# EAGLE board Oric Tactile KB 1.3b (EAGLE 6.5.0), part 1 of 3
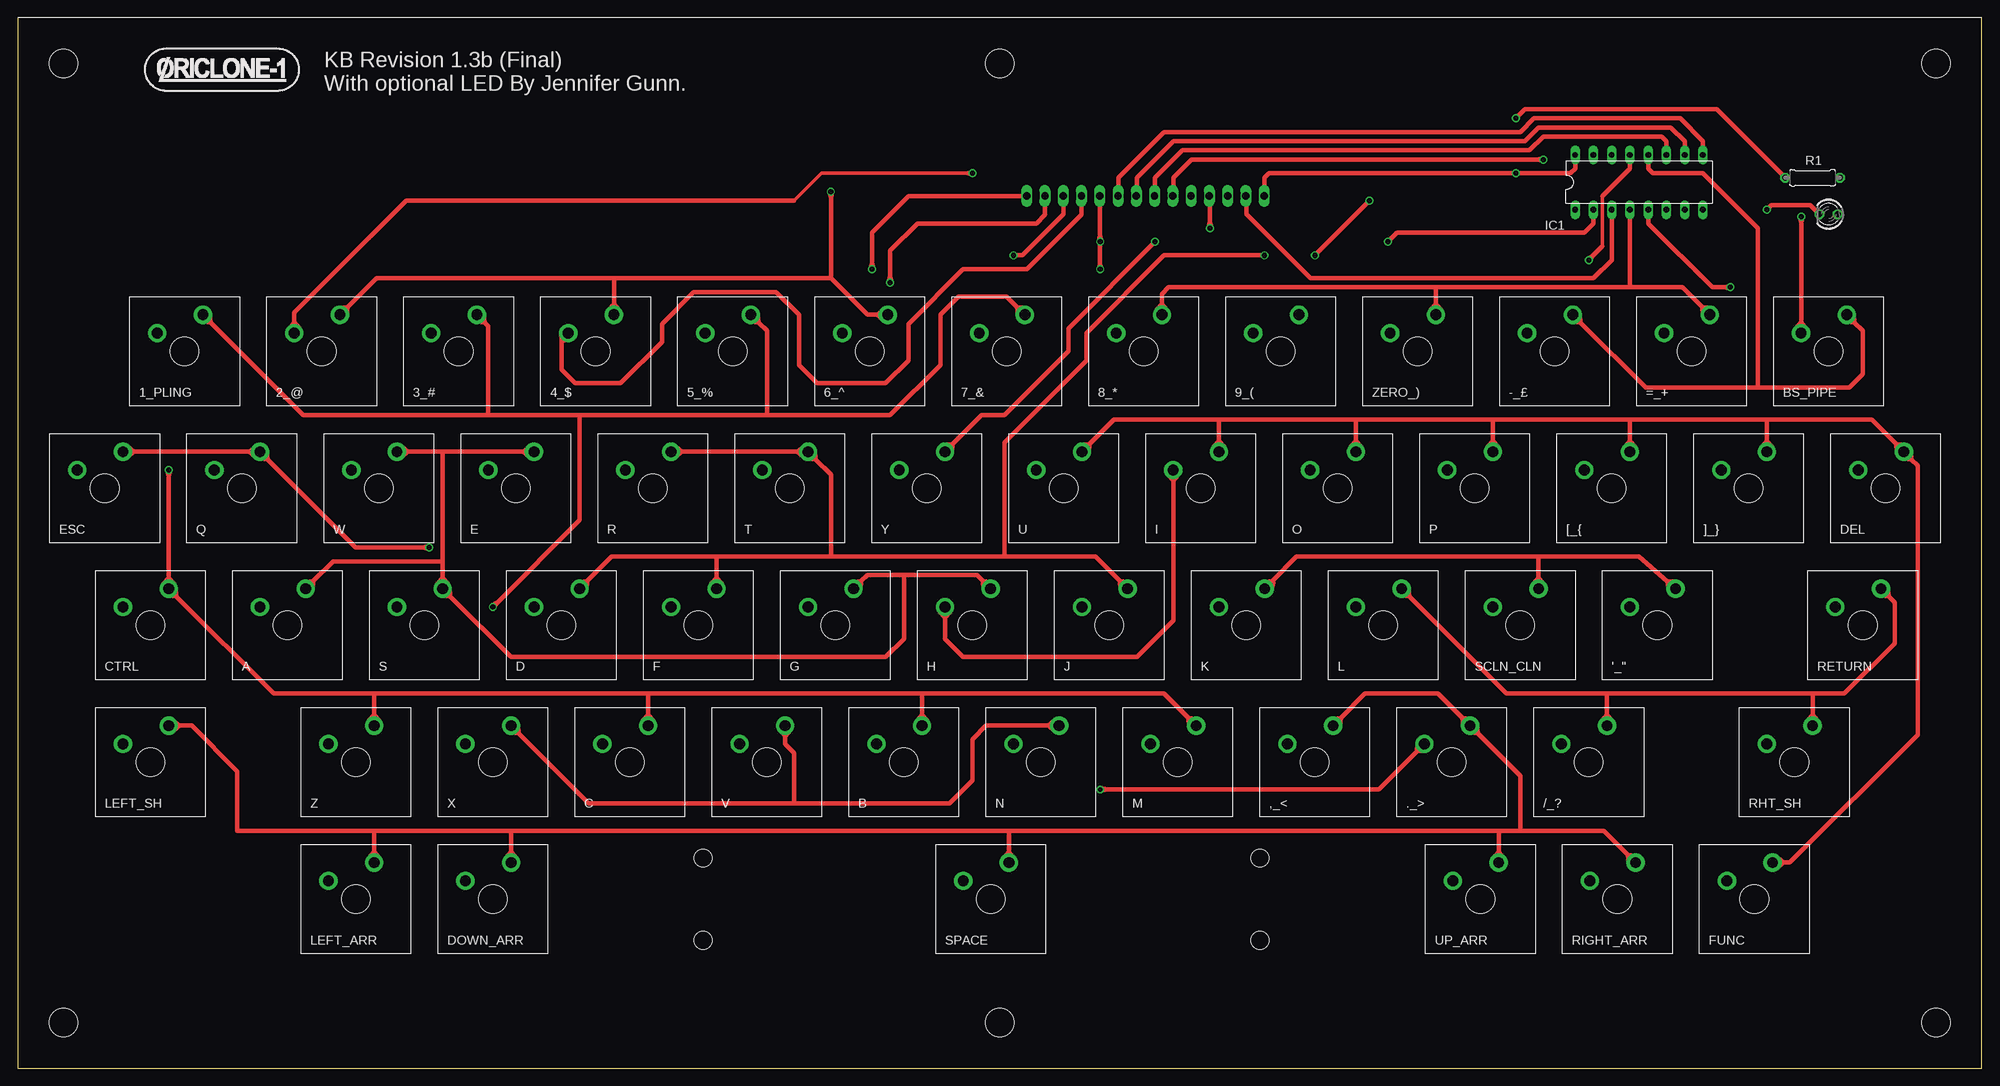
[diagram p2: board, top side]
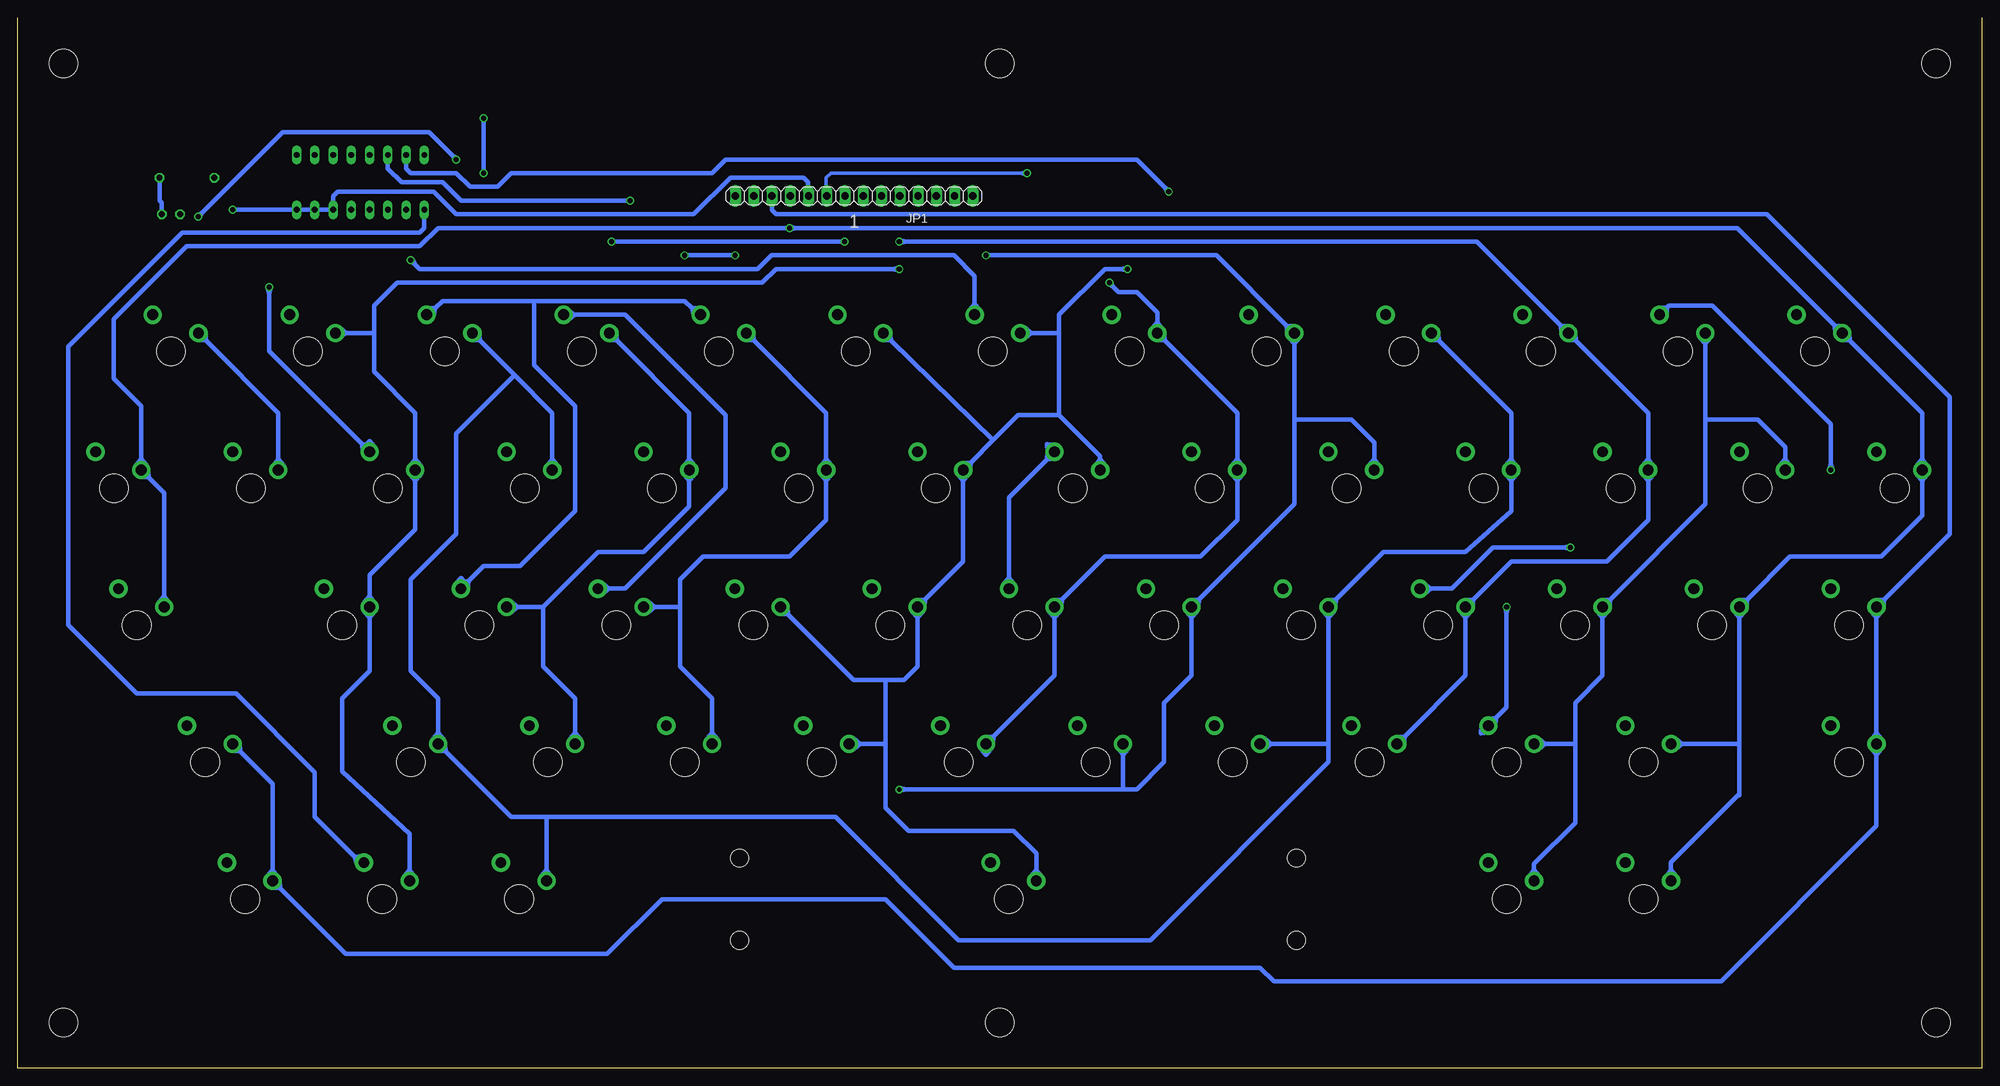
[diagram p3: board, bottom side, seen from below]

Size 273.05 x 146.05 mm. Coordinates in mm from the lower left corner, seen from the top.
Outline: 273.05,146.05 273.05,0 0,0 0,146.05
Copper layers (1*16): Top 0.035mm / dielectric 1.5mm / Bottom 0.035mm
Design rules "default": minimum track width 10mil, minimum drill 24mil, track to track 8mil, track to pad 8mil, pad to pad 8mil, via to via 8mil, smd to smd 8mil, copper to edge 40mil, drill to drill 8mil, minimum pad ring 10mil, minimum via ring 8mil, stop-mask expansion 4mil, vias tented up to drill 0mil, thermal gap 10mil
Net classes: 0 default: width 0.61 mm, clearance 0.254 mm
Holes 2.5 mm at 172.72,29.21 172.72,17.78 95.25,17.78 95.25,29.21
Holes 4 mm at 6.35,6.35 6.35,139.7 136.53,6.35 136.53,139.7 266.7,139.7 266.7,6.35

## Footprints (pad centres in the part's own frame; a part is rotated, then mirrored left to right if it is on the bottom)
CHERRY-MX = drill 1.5 pad 2.54: SW1 -3.81,2.54; SW2 2.54,5.08 | hole 4: 0,0
DIL16 = drill 0.813 long: 1 -8.89,-3.81; 2 -6.35,-3.81; 3 -3.81,-3.81; 4 -1.27,-3.81; 5 1.27,-3.81; 6 3.81,-3.81; 7 6.35,-3.81; 8 8.89,-3.81; 9 8.89,3.81; 10 6.35,3.81; 11 3.81,3.81; 12 1.27,3.81; 13 -1.27,3.81; 14 -3.81,3.81; 15 -6.35,3.81; 16 -8.89,3.81
1X14 = drill 1.016 long: 1 -16.51,0; 2 -13.97,0; 3 -11.43,0; 4 -8.89,0; 5 -6.35,0; 6 -3.81,0; 7 -1.27,0; 8 1.27,0; 9 3.81,0; 10 6.35,0; 11 8.89,0; 12 11.43,0; 13 13.97,0; 14 16.51,0
LED3MM = drill 0.813 octagon: A -1.27,0; K 1.27,0
0207/7 = drill 0.813 octagon: 1 -3.81,0; 2 3.81,0

## Placement (x,y rotation side)
1_PLING  CHERRY-MX  [CHERRY-MX]  23.18,99.69 0 top
2_@  CHERRY-MX  [CHERRY-MX]  42.23,99.69 0 top
3_#  CHERRY-MX  [CHERRY-MX]  61.28,99.69 0 top
4_$  CHERRY-MX  [CHERRY-MX]  80.33,99.69 0 top
5_%  CHERRY-MX  [CHERRY-MX]  99.38,99.69 0 top
6_^  CHERRY-MX  [CHERRY-MX]  118.43,99.69 0 top
7_&  CHERRY-MX  [CHERRY-MX]  137.48,99.69 0 top
8_*  CHERRY-MX  [CHERRY-MX]  156.53,99.69 0 top
9_(  CHERRY-MX  [CHERRY-MX]  175.58,99.69 0 top
'_"  CHERRY-MX  [CHERRY-MX]  227.97,61.59 0 top
,_<  CHERRY-MX  [CHERRY-MX]  180.34,42.55 0 top
-_£  CHERRY-MX  [CHERRY-MX]  213.68,99.69 0 top
._>  CHERRY-MX  [CHERRY-MX]  199.39,42.55 0 top
/_?  CHERRY-MX  [CHERRY-MX]  218.44,42.55 0 top
=_+  CHERRY-MX  [CHERRY-MX]  232.73,99.69 0 top
[_{  CHERRY-MX  [CHERRY-MX]  221.62,80.64 0 top
]_}  CHERRY-MX  [CHERRY-MX]  240.66,80.64 0 top
A  CHERRY-MX  [CHERRY-MX]  37.47,61.59 0 top
B  CHERRY-MX  [CHERRY-MX]  123.19,42.55 0 top
BS_PIPE  CHERRY-MX  [CHERRY-MX]  251.78,99.69 0 top
C  CHERRY-MX  [CHERRY-MX]  85.09,42.55 0 top
CTRL  CHERRY-MX  [CHERRY-MX]  18.41,61.59 0 top
D  CHERRY-MX  [CHERRY-MX]  75.56,61.59 0 top
DEL  CHERRY-MX  [CHERRY-MX]  259.71,80.64 0 top
DOWN_ARR  CHERRY-MX  [CHERRY-MX]  66.04,23.5 0 top
E  CHERRY-MX  [CHERRY-MX]  69.22,80.64 0 top
ESC  CHERRY-MX  [CHERRY-MX]  12.06,80.64 0 top
F  CHERRY-MX  [CHERRY-MX]  94.61,61.59 0 top
FUNC  CHERRY-MX  [CHERRY-MX]  241.46,23.5 0 top
G  CHERRY-MX  [CHERRY-MX]  113.67,61.59 0 top
H  CHERRY-MX  [CHERRY-MX]  132.72,61.59 0 top
I  CHERRY-MX  [CHERRY-MX]  164.47,80.64 0 top
IC1  4051N  [DIL16]  225.43,123.19 0 top
J  CHERRY-MX  [CHERRY-MX]  151.76,61.59 0 top
JP1  [1X14]  156.78,121.28 180 bottom
K  CHERRY-MX  [CHERRY-MX]  170.81,61.59 0 top
L  CHERRY-MX  [CHERRY-MX]  189.87,61.59 0 top
LED1  P-LED  [LED3MM]  251.78,118.75 180 top
LEFT_ARR  CHERRY-MX  [CHERRY-MX]  46.99,23.5 0 top
LEFT_SH  CHERRY-MX  [CHERRY-MX]  18.41,42.55 0 top
M  CHERRY-MX  [CHERRY-MX]  161.29,42.55 0 top
N  CHERRY-MX  [CHERRY-MX]  142.24,42.55 0 top
O  CHERRY-MX  [CHERRY-MX]  183.51,80.64 0 top
P  CHERRY-MX  [CHERRY-MX]  202.56,80.64 0 top
Q  CHERRY-MX  [CHERRY-MX]  31.11,80.64 0 top
R  CHERRY-MX  [CHERRY-MX]  88.27,80.64 0 top
R1  1K2  [0207/7]  249.56,123.83 180 top
RETURN  CHERRY-MX  [CHERRY-MX]  256.54,61.59 0 top
RHT_SH  CHERRY-MX  [CHERRY-MX]  247.01,42.55 0 top
RIGHT_ARR  CHERRY-MX  [CHERRY-MX]  222.41,23.5 0 top
S  CHERRY-MX  [CHERRY-MX]  56.52,61.59 0 top
SCLN_CLN  CHERRY-MX  [CHERRY-MX]  208.91,61.59 0 top
SPACE  CHERRY-MX  [CHERRY-MX]  135.25,23.5 0 top
T  CHERRY-MX  [CHERRY-MX]  107.31,80.64 0 top
U  CHERRY-MX  [CHERRY-MX]  145.41,80.64 0 top
U$1  [ORICLONE-1]  27.94,139.06 0 top
UP_ARR  CHERRY-MX  [CHERRY-MX]  203.36,23.5 0 top
V  CHERRY-MX  [CHERRY-MX]  104.14,42.55 0 top
W  CHERRY-MX  [CHERRY-MX]  50.16,80.64 0 top
X  CHERRY-MX  [CHERRY-MX]  66.04,42.55 0 top
Y  CHERRY-MX  [CHERRY-MX]  126.36,80.64 0 top
Z  CHERRY-MX  [CHERRY-MX]  46.99,42.55 0 top
ZERO_)  CHERRY-MX  [CHERRY-MX]  194.63,99.69 0 top

## Tracks (layer width: path | path; a pad name or v marks a point on that pad's centre or on a via)
+5V  (via drill 0.7)
  Top 0.61: JP1.14 173.35,123.83 173.99,124.46 v208.28,124.46 215.9,124.46 216.53,125.09 IC1.16 | R1.2 236.22,133.35 209.55,133.35 v208.28,132.08
  Bottom 0.61: v208.28,132.08 v208.28,124.46
COL_0  (via drill 0.7)
  Top 0.61: v118.75,111.12 118.75,112.04 | 118.75,112.04 118.75,116.2 123.83,121.28 JP1.1 | 118.55,111.17 | 118.75,112.04 118.55,111.17 | 118.75,112.04 118.55,111.17 | v118.75,111.12 118.55,111.17 | 118.75,112.04 | 118.75,112.04 118.94,111.17 | 118.75,112.04 118.55,111.17 | 118.75,112.04 118.94,111.17 | 118.94,111.17 | 118.75,112.04 118.55,111.17 | 118.75,112.04 118.94,111.17 | v118.75,111.12 118.94,111.17 | 118.75,112.04 118.55,111.17 | v118.75,111.12 118.55,111.17 | 118.75,112.04 118.94,111.17 | v118.75,111.12 118.94,111.17
  Bottom 0.61: U.SW1 140.54,84.25 | 140.54,84.25 | 140.54,84.25 137.48,87.31 | 137.48,87.31 133.99,90.81 128.27,90.81 | J.SW1 146.89,65.2 | 146.89,65.2 | 146.89,65.2 141.6,70.48 141.6,81.69 | 141.6,81.69 | 141.6,81.69 U.SW1 | 147.96,62.63 147.96,55.88 149.86,53.98 152.4,53.98 | 147.96,62.63 | 147.96,62.63 J.SW1 | SPACE.SW1 131.44,27.54 | 131.44,27.54 | 131.44,27.54 131.44,29.84 134.62,33.02 149.22,33.02 152.4,36.2 152.4,45.09 | 119.66,111.12 121.92,111.12 128.27,104.78 128.27,102.23 | 119.66,111.12 v118.75,111.12 | 152.4,53.98 152.4,45.09 | M.SW1 155.98,45.09 | 155.98,45.09 | 155.98,45.09 152.4,45.09 | 128.27,102.23 128.27,90.81 | Y.SW1 122.56,84.69 | 122.56,84.69 | 122.56,84.69 122.56,85.09 128.27,90.81 | 128.27,102.23 132.17,102.23 | 132.17,102.23 | 132.17,102.23 7_&.SW1 | 140.54,84.25 | 140.54,84.25 140.64,83.1 | 140.64,83.1 | 140.54,84.25 141.69,84.15 | 141.69,84.15 | 141.6,81.69 142.34,82.56 | 146.89,65.2 | 146.89,65.2 146.99,64.05 | 146.99,64.05 | 146.89,65.2 148.04,65.1 | 148.04,65.1 | 147.96,62.63 148.69,63.51 | J.SW1 148.58,64.87 J.SW1 | J.SW1 148.58,63.4 J.SW1 | 8_*.SW1 151.65,101.19 | 151.65,101.19 137.48,87.31 | K.SW1 165.94,63.07 | 165.94,63.07 156.84,53.98 152.4,53.98 | 118.79,111.32 | 118.79,110.93 | 151.65,101.19 | 151.65,101.19 | 151.65,101.19 151.76,102.33 | U.SW1 140.87,83.81 U.SW1 | J.SW1 147.33,63.4 | 147.33,64.87 | 119.66,111.12 118.79,111.32 | 119.66,111.12 | 119.66,111.12 118.79,110.93 | 119.66,111.12 118.79,111.32 | v118.75,111.12 118.79,111.32 | 119.66,111.12 118.79,110.93 | v118.75,111.12 118.79,110.93 | 119.66,111.12 118.79,111.32 | 119.66,111.12 118.79,110.93 | 119.66,111.12 118.79,111.32 | v118.75,111.12 118.79,111.32 | 119.66,111.12 118.79,110.93 | v118.75,111.12 118.79,110.93
  Bottom 0.61: 151.65,101.19 152.79,101.27 | 8_*.SW1 152.79,101.27 | 151.65,101.19 151.76,102.33 | 8_*.SW1 151.76,102.33 | 151.65,101.19 152.79,101.27 | 151.65,101.19 151.76,102.33 | 8_*.SW1 151.76,102.33 | 151.65,101.19 152.79,101.27 | 8_*.SW1 152.79,101.27 | 151.65,101.19 151.76,102.33 | 8_*.SW1 151.76,102.33 | 122.56,84.69 121.82,83.81 | 122.56,84.69 | 122.56,84.69 121.82,83.81 | Y.SW1 121.82,83.81 | 122.56,84.69 123.29,83.81 | 122.56,84.69 | 122.56,84.69 121.82,83.81 | 122.56,84.69 | 122.56,84.69 123.29,83.81 | 123.29,83.81 | 122.56,84.69 123.29,83.81 | 122.56,84.69 123.29,83.81 | Y.SW1 123.29,83.81 | 122.56,84.69 121.82,83.81 | Y.SW1 121.82,83.81 | 122.56,84.69 123.29,83.81 | 123.29,83.81 | 122.56,84.69 121.82,83.81 | 121.82,83.81 | Y.SW1 121.82,83.81 | 122.56,84.69 123.29,83.81 | Y.SW1 123.29,83.81 | 122.56,84.69 121.82,83.81 | Y.SW1 121.82,83.81 | 122.56,84.69 123.29,83.81 | Y.SW1 123.29,83.81 | U.SW1 142.34,83.81 | 141.6,81.69 140.87,82.56 | 140.54,84.25 140.64,83.1 | 140.64,83.1 | 140.54,84.25 | 140.54,84.25 140.64,83.1 | U.SW1 140.64,83.1 | 140.54,84.25 141.69,84.15 | 141.69,84.15 | U.SW1 141.69,84.15 | 141.6,81.69 | 141.6,81.69 142.34,82.56 | 142.34,82.56 | 141.6,81.69 | 141.6,81.69 140.87,82.56 | 141.6,81.69 142.34,82.56 | U.SW1 142.34,82.56 | 141.6,81.69 | 141.6,81.69 140.87,82.56 | U.SW1 140.87,82.56 | 140.54,84.25 140.64,83.1 | U.SW1 140.64,83.1 | 140.54,84.25 141.69,84.15 | U.SW1 141.69,84.15 | 141.6,81.69 142.34,82.56 | 141.6,81.69 140.87,82.56 | 140.87,82.56 | U.SW1 140.87,82.56 | 141.6,81.69 142.34,82.56 | 142.34,82.56 | U.SW1 142.34,82.56 | 141.6,81.69 140.87,82.56 | U.SW1 140.87,82.56 | 141.6,81.69 142.34,82.56 | U.SW1 142.34,82.56 | 141.6,81.69 140.87,82.56 | U.SW1 140.87,82.56 | 131.44,27.54 130.71,26.66
  Bottom 0.61: 131.44,27.54 | 131.44,27.54 130.71,26.66 | SPACE.SW1 130.71,26.66 | 131.44,27.54 132.18,26.66 | 131.44,27.54 | 131.44,27.54 130.71,26.66 | 131.44,27.54 | 131.44,27.54 132.18,26.66 | 132.18,26.66 | 131.44,27.54 132.18,26.66 | 131.44,27.54 132.18,26.66 | SPACE.SW1 132.18,26.66 | 131.44,27.54 130.71,26.66 | SPACE.SW1 130.71,26.66 | 131.44,27.54 132.18,26.66 | 132.18,26.66 | 131.44,27.54 130.71,26.66 | 130.71,26.66 | SPACE.SW1 130.71,26.66 | 131.44,27.54 132.18,26.66 | SPACE.SW1 132.18,26.66 | 131.44,27.54 130.71,26.66 | SPACE.SW1 130.71,26.66 | 131.44,27.54 132.18,26.66 | SPACE.SW1 132.18,26.66 | 165.94,63.07 | 165.94,63.07 167.09,63.17 | 167.09,63.17 | 165.94,63.07 | 165.94,63.07 166.04,64.22 | 166.04,64.22 | 165.94,63.07 167.09,63.17 | 167.09,63.17 | K.SW1 167.09,63.17 | 165.94,63.07 166.04,64.22 | K.SW1 166.04,64.22 | 165.94,63.07 167.09,63.17 | K.SW1 167.09,63.17 | 165.94,63.07 166.04,64.22 | K.SW1 166.04,64.22 | 155.98,45.09 156.86,44.35 | 155.98,45.09 | 155.98,45.09 156.86,44.35 | M.SW1 156.86,44.35 | 155.98,45.09 156.86,45.82 | 155.98,45.09 | 155.98,45.09 156.86,44.35 | 155.98,45.09 | 155.98,45.09 156.86,45.82 | 156.86,45.82 | 155.98,45.09 156.86,45.82 | 155.98,45.09 156.86,45.82 | M.SW1 156.86,45.82 | 155.98,45.09 156.86,44.35 | M.SW1 156.86,44.35 | 155.98,45.09 156.86,45.82 | 156.86,45.82 | 155.98,45.09 156.86,44.35 | 156.86,44.35 | M.SW1 156.86,44.35 | 155.98,45.09 156.86,45.82 | M.SW1 156.86,45.82 | 155.98,45.09 156.86,44.35 | M.SW1 156.86,44.35 | 155.98,45.09 156.86,45.82 | M.SW1 156.86,45.82 | 147.33,64.87 | 147.96,62.63 147.22,63.51 | 146.89,65.2 146.99,64.05 | 146.99,64.05 | 146.89,65.2 | 146.89,65.2 146.99,64.05 | J.SW1 146.99,64.05 | 146.89,65.2 148.04,65.1 | 148.04,65.1 | J.SW1 148.04,65.1
  Bottom 0.61: 147.33,63.4 | J.SW1 147.33,63.4 | J.SW1 147.33,64.87 | J.SW1 147.33,63.4 | J.SW1 147.33,64.87 | 147.96,62.63 | 147.96,62.63 148.69,63.51 | 148.69,63.51 | 147.96,62.63 | 147.96,62.63 147.22,63.51 | 147.96,62.63 148.69,63.51 | J.SW1 148.69,63.51 | 147.96,62.63 | 147.96,62.63 147.22,63.51 | J.SW1 147.22,63.51 | 146.89,65.2 146.99,64.05 | J.SW1 146.99,64.05 | 146.89,65.2 148.04,65.1 | J.SW1 148.04,65.1 | 147.96,62.63 148.69,63.51 | 147.96,62.63 147.22,63.51 | 147.22,63.51 | J.SW1 147.22,63.51 | 147.96,62.63 148.69,63.51 | 148.69,63.51 | J.SW1 148.69,63.51 | 147.96,62.63 147.22,63.51 | J.SW1 147.22,63.51 | 147.96,62.63 148.69,63.51 | J.SW1 148.69,63.51 | 147.96,62.63 147.22,63.51 | J.SW1 147.22,63.51 | 132.17,102.23 133.05,101.5 | 132.17,102.23 | 132.17,102.23 133.05,101.5 | 7_&.SW1 133.05,101.5 | 132.17,102.23 133.05,102.97 | 132.17,102.23 | 132.17,102.23 133.05,101.5 | 132.17,102.23 | 132.17,102.23 133.05,102.97 | 133.05,102.97 | 132.17,102.23 133.05,102.97 | 132.17,102.23 133.05,102.97 | 7_&.SW1 133.05,102.97 | 132.17,102.23 133.05,101.5 | 7_&.SW1 133.05,101.5 | 132.17,102.23 133.05,102.97 | 133.05,102.97 | 132.17,102.23 133.05,101.5 | 133.05,101.5 | 7_&.SW1 133.05,101.5 | 132.17,102.23 133.05,102.97 | 7_&.SW1 133.05,102.97 | 132.17,102.23 133.05,101.5 | 7_&.SW1 133.05,101.5 | 132.17,102.23 133.05,102.97 | 7_&.SW1 133.05,102.97
COL_1  (via drill 0.7)
  Top 0.61: v121.28,109.22 121.28,110.13 | 121.28,110.13 121.28,113.67 125.09,117.47 141.6,117.47 142.81,118.67 JP1.2 | 128.91,62.63 128.91,59.69 131.44,57.15 155.57,57.15 160.66,62.23 160.66,81.69 | 128.91,62.63 | 128.91,62.63 H.SW1 | I.SW1 160.66,81.69 | 160.66,81.69 | 128.91,62.63 129.64,63.51 | 160.66,81.69 161.39,82.56 | 121.09,109.27 | 121.28,110.13 121.09,109.27 | 121.28,110.13 121.09,109.27 | v121.28,109.22 121.09,109.27 | 121.28,110.13 | 121.28,110.13 121.48,109.27 | 121.28,110.13 121.09,109.27 | 121.28,110.13 121.48,109.27 | 121.48,109.27 | 121.28,110.13 121.09,109.27 | 121.28,110.13 121.48,109.27 | v121.28,109.22 121.48,109.27 | 121.28,110.13 121.09,109.27 | v121.28,109.22 121.09,109.27 | 121.28,110.13 121.48,109.27 | v121.28,109.22 121.48,109.27 | 128.91,62.63 128.17,63.51 | 128.91,62.63 | 128.91,62.63 129.64,63.51 | 129.64,63.51 | 128.91,62.63 | 128.91,62.63 128.17,63.51 | 128.91,62.63 129.64,63.51 | H.SW1 129.64,63.51 | 128.91,62.63 | 128.91,62.63 128.17,63.51 | H.SW1 128.17,63.51 | 128.91,62.63 129.64,63.51 | 128.91,62.63 128.17,63.51 | 128.17,63.51 | H.SW1 128.17,63.51 | 128.91,62.63 129.64,63.51 | 129.64,63.51 | H.SW1 129.64,63.51 | 128.91,62.63 128.17,63.51 | H.SW1 128.17,63.51 | 128.91,62.63 129.64,63.51 | H.SW1 129.64,63.51 | 128.91,62.63 128.17,63.51 | H.SW1 128.17,63.51 | 160.66,81.69 159.92,82.56 | 160.66,81.69 | 160.66,81.69 161.39,82.56 | 161.39,82.56 | 160.66,81.69 | 160.66,81.69 159.92,82.56 | 160.66,81.69 161.39,82.56 | I.SW1 161.39,82.56 | 160.66,81.69 | 160.66,81.69 159.92,82.56 | I.SW1 159.92,82.56 | 160.66,81.69 161.39,82.56 | 160.66,81.69 159.92,82.56 | 159.92,82.56 | I.SW1 159.92,82.56 | 160.66,81.69 161.39,82.56 | 161.39,82.56 | I.SW1 161.39,82.56 | 160.66,81.69 159.92,82.56
  Top 0.61: I.SW1 159.92,82.56 | 160.66,81.69 161.39,82.56 | I.SW1 161.39,82.56 | 160.66,81.69 159.92,82.56 | I.SW1 159.92,82.56
  Bottom 0.61: 6_^.SW1 113.56,101.17 | 113.56,101.17 103.5,91.12 103.5,84.69 | 103.5,84.69 | 103.5,84.69 T.SW1 | T.SW1 103.5,81.69 | 103.5,81.69 | 103.5,81.69 103.5,76.2 108.58,71.12 121.92,71.12 127.84,65.2 | 127.84,65.2 | 127.84,65.2 H.SW1 | H.SW1 128.91,62.63 | 128.91,62.63 | 128.91,62.63 128.91,54.61 137.37,46.15 | 137.37,46.15 | 137.37,46.15 N.SW1 | 9_(.SW1 170.71,101.17 | 170.71,101.17 160.66,91.12 160.66,84.69 | 160.66,84.69 | 160.66,84.69 I.SW1 | I.SW1 160.66,81.69 | 160.66,81.69 | 160.66,81.69 160.66,76.2 165.74,71.12 177.8,71.12 180.97,67.94 180.97,64.14 | 180.97,64.14 180.97,55.88 176.53,51.44 176.53,46.59 | 176.53,46.59 | 176.53,46.59 ,_<.SW1 | L.SW1 184.56,64.14 | 184.56,64.14 | 184.56,64.14 180.97,64.14 | 6_^.SW1 114.62,103.73 | 114.62,103.73 | 114.62,103.73 114.62,105.09 117.47,107.95 120.02,107.95 120.64,108.57 | 120.64,108.57 v121.28,109.22 | 127.84,65.2 | 127.84,65.2 127.94,64.05 | 127.94,64.05 | 127.84,65.2 128.99,65.1 | 128.99,65.1 | 128.91,62.63 129.64,63.51 | 160.66,81.69 161.39,82.56 | 103.5,81.69 104.24,82.56 | 137.37,46.15 | 137.37,46.15 137.47,45 | 137.47,45 | 137.37,46.15 138.51,46.05 | 138.51,46.05 | 120.64,108.57 121.39,109.05 | 120.64,108.57 121.11,109.33 | 120.64,108.57 121.39,109.05 | 121.39,109.05 | 120.64,108.57 121.11,109.33 | 121.11,109.33 | H.SW1 128.28,63.4 H.SW1 | H.SW1 128.28,64.87 H.SW1 | 120.64,108.57 121.39,109.05 | v121.28,109.22 121.39,109.05 | 120.64,108.57 121.11,109.33 | v121.28,109.22 121.11,109.33 | 120.64,108.57 121.39,109.05 | 120.64,108.57 121.11,109.33 | 120.64,108.57 121.39,109.05 | v121.28,109.22 121.39,109.05 | 120.64,108.57 121.11,109.33 | v121.28,109.22 121.11,109.33 | 120.64,108.57 121.39,109.05 | 120.64,108.57 121.11,109.33
  Bottom 0.61: 120.64,108.57 121.39,109.05 | v121.28,109.22 121.39,109.05 | 120.64,108.57 121.11,109.33 | v121.28,109.22 121.11,109.33 | 184.56,64.14 185.43,63.4 | 184.56,64.14 | 184.56,64.14 185.43,63.4 | L.SW1 185.43,63.4 | 184.56,64.14 185.43,64.87 | 184.56,64.14 | 184.56,64.14 185.43,63.4 | 184.56,64.14 | 184.56,64.14 185.43,64.87 | 185.43,64.87 | 184.56,64.14 185.43,64.87 | 184.56,64.14 185.43,64.87 | L.SW1 185.43,64.87 | 184.56,64.14 185.43,63.4 | L.SW1 185.43,63.4 | 184.56,64.14 185.43,64.87 | 185.43,64.87 | 184.56,64.14 185.43,63.4 | 185.43,63.4 | L.SW1 185.43,63.4 | 184.56,64.14 185.43,64.87 | L.SW1 185.43,64.87 | 184.56,64.14 185.43,63.4 | L.SW1 185.43,63.4 | 184.56,64.14 185.43,64.87 | L.SW1 185.43,64.87 | 128.91,62.63 128.17,63.51 | 127.84,65.2 127.94,64.05 | 127.94,64.05 | 127.84,65.2 | 127.84,65.2 127.94,64.05 | H.SW1 127.94,64.05 | 127.84,65.2 128.99,65.1 | 128.99,65.1 | H.SW1 128.99,65.1 | 128.91,62.63 | 128.91,62.63 129.64,63.51 | 129.64,63.51 | 128.91,62.63 | 128.91,62.63 128.17,63.51 | 128.91,62.63 129.64,63.51 | H.SW1 129.64,63.51 | 128.91,62.63 | 128.91,62.63 128.17,63.51 | H.SW1 128.17,63.51 | 127.84,65.2 127.94,64.05 | H.SW1 127.94,64.05 | 127.84,65.2 128.99,65.1 | H.SW1 128.99,65.1 | 128.91,62.63 129.64,63.51 | 128.91,62.63 128.17,63.51 | 128.17,63.51 | H.SW1 128.17,63.51 | 128.91,62.63 129.64,63.51 | 129.64,63.51 | H.SW1 129.64,63.51 | 128.91,62.63 128.17,63.51 | H.SW1 128.17,63.51 | 128.91,62.63 129.64,63.51 | H.SW1 129.64,63.51 | 128.91,62.63 128.17,63.51 | H.SW1 128.17,63.51 | 160.66,84.69 159.92,83.81 | 160.66,81.69 159.92,82.56 | 160.66,84.69 | 160.66,84.69 159.92,83.81 | I.SW1 159.92,83.81 | 160.66,84.69 161.39,83.81 | 160.66,84.69 | 160.66,84.69 159.92,83.81 | 160.66,84.69 | 160.66,84.69 161.39,83.81
  Bottom 0.61: 161.39,83.81 | 160.66,81.69 | 160.66,81.69 161.39,82.56 | 161.39,82.56 | 160.66,81.69 | 160.66,81.69 159.92,82.56 | 160.66,81.69 161.39,82.56 | I.SW1 161.39,82.56 | 160.66,81.69 | 160.66,81.69 159.92,82.56 | I.SW1 159.92,82.56 | 160.66,84.69 161.39,83.81 | 160.66,84.69 161.39,83.81 | I.SW1 161.39,83.81 | 160.66,84.69 159.92,83.81 | I.SW1 159.92,83.81 | 160.66,84.69 161.39,83.81 | 161.39,83.81 | 160.66,84.69 159.92,83.81 | 159.92,83.81 | I.SW1 159.92,83.81 | 160.66,84.69 161.39,83.81 | I.SW1 161.39,83.81 | 160.66,84.69 159.92,83.81 | I.SW1 159.92,83.81 | 160.66,84.69 161.39,83.81 | I.SW1 161.39,83.81 | 160.66,81.69 161.39,82.56 | 160.66,81.69 159.92,82.56 | 159.92,82.56 | I.SW1 159.92,82.56 | 160.66,81.69 161.39,82.56 | 161.39,82.56 | I.SW1 161.39,82.56 | 160.66,81.69 159.92,82.56 | I.SW1 159.92,82.56 | 160.66,81.69 161.39,82.56 | I.SW1 161.39,82.56 | 160.66,81.69 159.92,82.56 | I.SW1 159.92,82.56 | 176.53,46.59 175.79,45.71 | 176.53,46.59 | 176.53,46.59 175.79,45.71 | ,_<.SW1 175.79,45.71 | 176.53,46.59 177.27,45.71 | 176.53,46.59 | 176.53,46.59 175.79,45.71 | 176.53,46.59 | 176.53,46.59 177.27,45.71 | 177.27,45.71 | 176.53,46.59 177.27,45.71 | 176.53,46.59 177.27,45.71 | ,_<.SW1 177.27,45.71 | 176.53,46.59 175.79,45.71 | ,_<.SW1 175.79,45.71 | 176.53,46.59 177.27,45.71 | 177.27,45.71 | 176.53,46.59 175.79,45.71 | 175.79,45.71 | ,_<.SW1 175.79,45.71 | 176.53,46.59 177.27,45.71 | ,_<.SW1 177.27,45.71 | 176.53,46.59 175.79,45.71 | ,_<.SW1 175.79,45.71 | 176.53,46.59 177.27,45.71 | ,_<.SW1 177.27,45.71 | 170.71,101.17 | 170.71,101.17 171.85,101.27 | 171.85,101.27 | 170.71,101.17 | 170.71,101.17 170.81,102.32 | 170.81,102.32 | 170.71,101.17 170.81,102.32 | 170.81,102.32 | 170.71,101.17 171.85,101.27
  Bottom 0.61: 171.85,101.27 | 9_(.SW1 171.85,101.27 | 170.71,101.17 170.81,102.32 | 9_(.SW1 170.81,102.32 | 170.71,101.17 171.85,101.27 | 9_(.SW1 171.85,101.27 | 170.71,101.17 170.81,102.32 | 9_(.SW1 170.81,102.32 | 113.56,101.17 | 113.56,101.17 114.7,101.27 | 114.7,101.27 | 113.56,101.17 | 113.56,101.17 113.66,102.32 | 113.66,102.32 | 114.62,103.73 113.88,102.86 | 113.56,101.17 113.66,102.32 | 113.66,102.32 | 114.62,103.73 | 114.62,103.73 113.88,102.86 | 6_^.SW1 113.88,102.86 | 114.62,103.73 115.36,102.86 | 114.62,103.73 | 114.62,103.73 113.88,102.86 | 114.62,103.73 | 114.62,103.73 115.36,102.86 | 115.36,102.86 | 113.56,101.17 114.7,101.27 | 114.7,101.27 | 6_^.SW1 114.7,101.27 | 113.56,101.17 113.66,102.32 | 6_^.SW1 113.66,102.32 | 113.56,101.17 114.7,101.27 | 6_^.SW1 114.7,101.27 | 113.56,101.17 113.66,102.32 | 6_^.SW1 113.66,102.32 | 114.62,103.73 115.36,102.86 | 114.62,103.73 115.36,102.86 | 6_^.SW1 115.36,102.86 | 114.62,103.73 113.88,102.86 | 6_^.SW1 113.88,102.86 | 114.62,103.73 115.36,102.86 | 115.36,102.86 | 114.62,103.73 113.88,102.86 | 113.88,102.86 | 6_^.SW1 113.88,102.86 | 114.62,103.73 115.36,102.86 | 6_^.SW1 115.36,102.86 | 114.62,103.73 113.88,102.86 | 6_^.SW1 113.88,102.86 | 114.62,103.73 115.36,102.86 | 6_^.SW1 115.36,102.86 | 103.5,84.69 102.77,83.81 | 103.5,81.69 102.77,82.56 | 103.5,84.69 | 103.5,84.69 102.77,83.81 | T.SW1 102.77,83.81 | 103.5,84.69 104.24,83.81 | 103.5,84.69 | 103.5,84.69 102.77,83.81 | 103.5,84.69 | 103.5,84.69 104.24,83.81 | 104.24,83.81 | 103.5,81.69 | 103.5,81.69 104.24,82.56 | 104.24,82.56 | 103.5,81.69 | 103.5,81.69 102.77,82.56 | 103.5,81.69 104.24,82.56 | T.SW1 104.24,82.56 | 103.5,81.69 | 103.5,81.69 102.77,82.56 | T.SW1 102.77,82.56 | 103.5,84.69 104.24,83.81
  Bottom 0.61: 103.5,84.69 104.24,83.81 | T.SW1 104.24,83.81 | 103.5,84.69 102.77,83.81 | T.SW1 102.77,83.81 | 103.5,84.69 104.24,83.81 | 104.24,83.81 | 103.5,84.69 102.77,83.81 | 102.77,83.81 | T.SW1 102.77,83.81 | 103.5,84.69 104.24,83.81 | T.SW1 104.24,83.81 | 103.5,84.69 102.77,83.81 | T.SW1 102.77,83.81 | 103.5,84.69 104.24,83.81 | T.SW1 104.24,83.81 | 103.5,81.69 104.24,82.56 | 103.5,81.69 102.77,82.56 | 102.77,82.56 | T.SW1 102.77,82.56 | 103.5,81.69 104.24,82.56 | 104.24,82.56 | T.SW1 104.24,82.56 | 103.5,81.69 102.77,82.56 | T.SW1 102.77,82.56 | 103.5,81.69 104.24,82.56 | T.SW1 104.24,82.56 | 103.5,81.69 102.77,82.56 | T.SW1 102.77,82.56 | N.SW1 139.17,44.46 138.43,43.59 137.69,44.46 N.SW1 | 137.37,46.15 137.47,45 | 137.47,45 | 137.37,46.15 | 137.37,46.15 137.47,45 | N.SW1 137.47,45 | 137.37,46.15 138.51,46.05 | 138.51,46.05 | N.SW1 138.51,46.05 | 137.37,46.15 137.47,45 | N.SW1 137.47,45 | 137.37,46.15 138.51,46.05 | N.SW1 138.51,46.05
COL_2  (via drill 0.61, 0.7)
  Top 0.61: 151.41,38.73 189.23,38.73 194.52,44.02 | 151.41,38.73 v150.5,38.73 | ._>.SW1 194.52,44.02 | 150.54,38.93 | 150.54,38.54 | 151.41,38.73 150.54,38.93 | 151.41,38.73 | 151.41,38.73 150.54,38.54 | 151.41,38.73 150.54,38.93 | v150.5,38.73 150.54,38.93 | 151.41,38.73 150.54,38.54 | v150.5,38.73 150.54,38.54 | 151.41,38.73 150.54,38.93 | 151.41,38.73 150.54,38.54 | 151.41,38.73 150.54,38.93 | v150.5,38.73 150.54,38.93 | 151.41,38.73 150.54,38.54 | v150.5,38.73 150.54,38.54 | 194.52,44.02 | 194.52,44.02 195.66,44.12 | 195.66,44.12 | 194.52,44.02 | 194.52,44.02 194.62,45.17 | 194.62,45.17 | 194.52,44.02 194.62,45.17 | 194.62,45.17 | 194.52,44.02 195.66,44.12 | 195.66,44.12 | ._>.SW1 195.66,44.12 | 194.52,44.02 194.62,45.17 | ._>.SW1 194.62,45.17 | 194.52,44.02 195.66,44.12 | ._>.SW1 195.66,44.12 | 194.52,44.02 194.62,45.17 | ._>.SW1 194.62,45.17 | v138.43,113.03 139.7,113.03 145.41,118.75 145.41,121.22 JP1.3
  Bottom 0.61: G.SW1 108.79,65.2 | 108.79,65.2 | 108.79,65.2 95.57,78.42 95.57,90.17 | ZERO_).SW1 189.76,101.17 | 189.76,101.17 179.71,91.12 179.71,84.69 | 179.71,84.69 | 179.71,84.69 O.SW1 | O.SW1 179.71,81.69 | 179.71,81.69 | 179.71,81.69 179.71,78.11 186.06,71.75 192.41,71.75 200.03,64.14 | 200.03,64.14 200.03,55.88 195.58,51.44 195.58,46.59 | 195.58,46.59 | 195.58,46.59 ._>.SW1 | SCLN_CLN.SW1 203.6,64.14 | 203.6,64.14 | 203.6,64.14 200.03,64.14 | G.SW1 109.86,62.63 | 109.86,62.63 | 109.86,62.63 109.86,54.61 113.67,50.8 113.67,42.55 117.47,38.73 119.38,38.73 | v150.5,38.73 149.58,38.73 | 149.58,38.73 119.38,38.73 | B.SW1 119.38,43.59 | 119.38,43.59 | 119.38,43.59 119.38,38.73 | 5_%.SW1 96.63,103.3 | 96.63,103.3 | 96.63,103.3 106.36,113.03 v138.43,113.03 | 5_%.SW1 95.57,100.73 | 95.57,100.73 | 95.57,100.73 95.57,90.17 | R.SW1 84.45,84.69 | 84.45,84.69 | 84.45,84.69 84.45,87 87.63,90.17 95.57,90.17 | 108.79,65.2 | 108.79,65.2 108.89,64.05 | 108.89,64.05 | 108.79,65.2 109.94,65.1 | 109.94,65.1 | 109.86,62.63 110.59,63.51 | 179.71,81.69 180.44,82.56 | 119.38,43.59 120.12,44.46 | 96.63,103.3 95.48,103.2 | 95.48,103.2 | 96.63,103.3 96.53,102.15 | 96.53,102.15 | 95.57,100.73 96.31,101.61 | 150.45,38.54 | 5_%.SW1 96.31,102.86 5_%.SW1 | 96.53,102.15 | 149.58,38.73 150.45,38.54 | 149.58,38.73 150.45,38.54 | v150.5,38.73 150.45,38.54 | 149.58,38.73 | 149.58,38.73 150.45,38.93 | 149.58,38.73 150.45,38.54 | 149.58,38.73 150.45,38.93 | 150.45,38.93 | 149.58,38.73 150.45,38.54 | 149.58,38.73 150.45,38.93 | v150.5,38.73 150.45,38.93 | 149.58,38.73 150.45,38.54 | v150.5,38.73 150.45,38.54 | 149.58,38.73 150.45,38.93 | v150.5,38.73 150.45,38.93 | 189.76,101.17 | 189.76,101.17 190.9,101.27 | 190.9,101.27
  Bottom 0.61: 189.76,101.17 | 189.76,101.17 189.86,102.32 | 189.86,102.32 | 189.76,101.17 189.86,102.32 | 189.86,102.32 | 189.76,101.17 190.9,101.27 | 190.9,101.27 | ZERO_).SW1 190.9,101.27 | 189.76,101.17 189.86,102.32 | ZERO_).SW1 189.86,102.32 | 189.76,101.17 190.9,101.27 | ZERO_).SW1 190.9,101.27 | 189.76,101.17 189.86,102.32 | ZERO_).SW1 189.86,102.32 | G.SW1 109.94,63.17 | G.SW1 108.89,64.22 | 109.86,62.63 109.12,63.51 | 108.79,65.2 108.89,64.05 | 108.89,64.05 | 108.79,65.2 | 108.79,65.2 108.89,64.05 | G.SW1 108.89,64.05 | 108.79,65.2 109.94,65.1 | 109.94,65.1 | G.SW1 109.94,65.1 | 109.86,62.63 | 109.86,62.63 110.59,63.51 | 110.59,63.51 | 109.86,62.63 | 109.86,62.63 109.12,63.51 | 109.86,62.63 110.59,63.51 | G.SW1 110.59,63.51 | 109.86,62.63 | 109.86,62.63 109.12,63.51 | G.SW1 109.12,63.51 | 108.79,65.2 108.89,64.05 | G.SW1 108.89,64.05 | 108.79,65.2 109.94,65.1 | G.SW1 109.94,65.1 | 109.86,62.63 110.59,63.51 | 109.86,62.63 109.12,63.51 | 109.12,63.51 | G.SW1 109.12,63.51 | 109.86,62.63 110.59,63.51 | 110.59,63.51 | G.SW1 110.59,63.51 | 109.86,62.63 109.12,63.51 | G.SW1 109.12,63.51 | 109.86,62.63 110.59,63.51 | G.SW1 110.59,63.51 | 109.86,62.63 109.12,63.51 | G.SW1 109.12,63.51 | 179.71,84.69 178.97,83.81 | 179.71,81.69 178.97,82.56 | 179.71,84.69 | 179.71,84.69 178.97,83.81 | O.SW1 178.97,83.81 | 179.71,84.69 180.44,83.81 | 179.71,84.69 | 179.71,84.69 178.97,83.81 | 179.71,84.69 | 179.71,84.69 180.44,83.81 | 180.44,83.81 | 179.71,81.69 | 179.71,81.69 180.44,82.56 | 180.44,82.56 | 179.71,81.69 | 179.71,81.69 178.97,82.56 | 179.71,81.69 180.44,82.56 | O.SW1 180.44,82.56 | 179.71,81.69 | 179.71,81.69 178.97,82.56 | O.SW1 178.97,82.56 | 179.71,84.69 180.44,83.81 | 179.71,84.69 180.44,83.81 | O.SW1 180.44,83.81
  Bottom 0.61: 179.71,84.69 178.97,83.81 | O.SW1 178.97,83.81 | 179.71,84.69 180.44,83.81 | 180.44,83.81 | 179.71,84.69 178.97,83.81 | 178.97,83.81 | O.SW1 178.97,83.81 | 179.71,84.69 180.44,83.81 | O.SW1 180.44,83.81 | 179.71,84.69 178.97,83.81 | O.SW1 178.97,83.81 | 179.71,84.69 180.44,83.81 | O.SW1 180.44,83.81 | 179.71,81.69 180.44,82.56 | 179.71,81.69 178.97,82.56 | 178.97,82.56 | O.SW1 178.97,82.56 | 179.71,81.69 180.44,82.56 | 180.44,82.56 | O.SW1 180.44,82.56 | 179.71,81.69 178.97,82.56 | O.SW1 178.97,82.56 | 179.71,81.69 180.44,82.56 | O.SW1 180.44,82.56 | 179.71,81.69 178.97,82.56 | O.SW1 178.97,82.56 | 195.58,46.59 194.84,45.71 | 195.58,46.59 | 195.58,46.59 194.84,45.71 | ._>.SW1 194.84,45.71 | 195.58,46.59 196.32,45.71 | 195.58,46.59 | 195.58,46.59 194.84,45.71 | 195.58,46.59 | 195.58,46.59 196.32,45.71 | 196.32,45.71 | 195.58,46.59 196.32,45.71 | 195.58,46.59 196.32,45.71 | ._>.SW1 196.32,45.71 | 195.58,46.59 194.84,45.71 | ._>.SW1 194.84,45.71 | 195.58,46.59 196.32,45.71 | 196.32,45.71 | 195.58,46.59 194.84,45.71 | 194.84,45.71 | ._>.SW1 194.84,45.71 | 195.58,46.59 196.32,45.71 | ._>.SW1 196.32,45.71 | 195.58,46.59 194.84,45.71 | ._>.SW1 194.84,45.71 | 195.58,46.59 196.32,45.71 | ._>.SW1 196.32,45.71 | 203.6,64.14 204.48,63.4 | 203.6,64.14 | 203.6,64.14 204.48,63.4 | SCLN_CLN.SW1 204.48,63.4 | 203.6,64.14 204.48,64.87 | 203.6,64.14 | 203.6,64.14 204.48,63.4 | 203.6,64.14 | 203.6,64.14 204.48,64.87 | 204.48,64.87 | 203.6,64.14 204.48,64.87 | 203.6,64.14 204.48,64.87 | SCLN_CLN.SW1 204.48,64.87 | 203.6,64.14 204.48,63.4 | SCLN_CLN.SW1 204.48,63.4 | 203.6,64.14 204.48,64.87 | 204.48,64.87 | 203.6,64.14 204.48,63.4 | 204.48,63.4 | SCLN_CLN.SW1 204.48,63.4 | 203.6,64.14 204.48,64.87 | SCLN_CLN.SW1 204.48,64.87
  Bottom 0.61: 203.6,64.14 204.48,63.4 | SCLN_CLN.SW1 204.48,63.4 | 203.6,64.14 204.48,64.87 | SCLN_CLN.SW1 204.48,64.87 | 119.38,43.59 118.64,44.46 | 119.38,43.59 | 119.38,43.59 120.12,44.46 | 120.12,44.46 | 119.38,43.59 | 119.38,43.59 118.64,44.46 | 119.38,43.59 120.12,44.46 | B.SW1 120.12,44.46 | 119.38,43.59 | 119.38,43.59 118.64,44.46 | B.SW1 118.64,44.46 | 119.38,43.59 120.12,44.46 | 119.38,43.59 118.64,44.46 | 118.64,44.46 | B.SW1 118.64,44.46 | 119.38,43.59 120.12,44.46 | 120.12,44.46 | B.SW1 120.12,44.46 | 119.38,43.59 118.64,44.46 | B.SW1 118.64,44.46 | 119.38,43.59 120.12,44.46 | B.SW1 120.12,44.46 | 119.38,43.59 118.64,44.46 | B.SW1 118.64,44.46 | 84.45,84.69 83.72,83.81 | 84.45,84.69 | 84.45,84.69 83.72,83.81 | R.SW1 83.72,83.81 | 84.45,84.69 85.19,83.81 | 84.45,84.69 | 84.45,84.69 83.72,83.81 | 84.45,84.69 | 84.45,84.69 85.19,83.81 | 85.19,83.81 | 84.45,84.69 85.19,83.81 | 84.45,84.69 85.19,83.81 | R.SW1 85.19,83.81 | 84.45,84.69 83.72,83.81 | R.SW1 83.72,83.81 | 84.45,84.69 85.19,83.81 | 85.19,83.81 | 84.45,84.69 83.72,83.81 | 83.72,83.81 | R.SW1 83.72,83.81 | 84.45,84.69 85.19,83.81 | R.SW1 85.19,83.81 | 84.45,84.69 83.72,83.81 | R.SW1 83.72,83.81 | 84.45,84.69 85.19,83.81 | R.SW1 85.19,83.81 | 95.57,100.73 94.83,101.61 | 95.48,103.2 | 5_%.SW1 95.48,103.2 | 96.63,103.3 96.53,102.15 | 5_%.SW1 96.53,102.15 | 96.63,103.3 95.48,103.2 | 5_%.SW1 95.48,103.2 | 96.63,103.3 96.53,102.15 | 5_%.SW1 96.53,102.15 | 95.57,100.73 | 95.57,100.73 96.31,101.61 | 96.31,101.61 | 95.57,100.73 | 95.57,100.73 94.83,101.61 | 95.57,100.73 96.31,101.61 | 5_%.SW1 96.31,101.61 | 95.57,100.73 | 95.57,100.73 94.83,101.61 | 5_%.SW1 94.83,101.61 | 95.57,100.73 96.31,101.61 | 95.57,100.73 94.83,101.61 | 94.83,101.61 | 5_%.SW1 94.83,101.61
  Bottom 0.61: 95.57,100.73 96.31,101.61 | 96.31,101.61 | 5_%.SW1 96.31,101.61 | 95.57,100.73 94.83,101.61 | 5_%.SW1 94.83,101.61 | 95.57,100.73 96.31,101.61 | 5_%.SW1 96.31,101.61 | 95.57,100.73 94.83,101.61 | 5_%.SW1 94.83,101.61
COL_3
  Top 0.61: JP1.4 147.88,118.67 140.34,111.12 131.44,111.12 123.83,103.5 123.83,98.42 120.65,95.25 111.12,95.25 108.58,97.79 108.58,104.78 105.41,107.95 93.98,107.95 89.53,103.5 89.53,100.97 83.82,95.25 77.47,95.25 75.56,97.16 75.56,101.08 | 4_$.SW1 75.56,101.28 75.56,101.08 | 75.56,101.08 76.69,101.29 4_$.SW1 | 75.56,101.08 75.55,102.22 4_$.SW1
  Bottom 0.61: 4_$.SW1 75.46,101.17 | 75.46,101.17 65.41,91.12 65.41,84.69 | 65.41,84.69 | 65.41,84.69 E.SW1 | E.SW1 65.41,81.69 | 65.41,81.69 | 65.41,81.69 65.41,77.47 71.75,71.75 83.19,71.75 89.74,65.2 | 89.74,65.2 | 89.74,65.2 F.SW1 | -_£.SW1 208.81,101.17 | 208.81,101.17 203.99,96.36 | 203.99,96.36 198.75,91.12 198.75,84.69 | 198.75,84.69 | 198.75,84.69 P.SW1 | 214.63,46.59 214.63,51.44 218.44,55.24 218.44,67.94 212.09,74.3 212.09,88.27 203.99,96.36 | 214.63,46.59 | 214.63,46.59 /_?.SW1 | 90.81,45.09 90.81,42.55 115.57,17.78 142.24,17.78 159.38,34.92 199.55,34.92 | 90.81,45.09 90.81,62.63 | 90.81,62.63 | 90.81,62.63 F.SW1 | V.SW1 98.83,45.09 | 98.83,45.09 | 98.83,45.09 90.81,45.09 | 199.55,34.92 204.47,34.92 213.57,44.02 | 65.41,81.69 66.14,82.56 | 89.74,65.2 | 89.74,65.2 89.84,64.05 | 89.84,64.05 | 89.74,65.2 90.89,65.1 | 90.89,65.1 | 90.81,62.63 91.54,63.51 | UP_ARR.SW1 199.55,27.54 | 199.55,27.54 199.55,34.92 | /_?.SW1 213.57,44.02 | 214.63,46.59 213.89,45.71 | 214.63,46.59 | 214.63,46.59 213.89,45.71 | /_?.SW1 213.89,45.71 | 214.63,46.59 215.37,45.71 | 214.63,46.59 | 214.63,46.59 213.89,45.71 | 214.63,46.59 | 214.63,46.59 215.37,45.71 | 215.37,45.71 | 214.63,46.59 215.37,45.71 | 214.63,46.59 215.37,45.71 | /_?.SW1 215.37,45.71 | 214.63,46.59 213.89,45.71 | /_?.SW1 213.89,45.71 | 214.63,46.59 215.37,45.71 | 215.37,45.71 | 214.63,46.59 213.89,45.71 | 213.89,45.71 | /_?.SW1 213.89,45.71 | 214.63,46.59 215.37,45.71 | /_?.SW1 215.37,45.71 | 214.63,46.59 213.89,45.71 | /_?.SW1 213.89,45.71 | 214.63,46.59 215.37,45.71 | /_?.SW1 215.37,45.71 | 213.57,44.02 214.71,44.12 /_?.SW1 | 213.57,44.02 213.67,45.17 /_?.SW1 | 65.41,84.69 64.67,83.81 | 65.41,81.69 64.67,82.56 | 65.41,84.69 | 65.41,84.69 64.67,83.81
  Bottom 0.61: E.SW1 64.67,83.81 | 65.41,84.69 66.14,83.81 | 65.41,84.69 | 65.41,84.69 64.67,83.81 | 65.41,84.69 | 65.41,84.69 66.14,83.81 | 66.14,83.81 | 65.41,81.69 | 65.41,81.69 66.14,82.56 | 66.14,82.56 | 65.41,81.69 | 65.41,81.69 64.67,82.56 | 65.41,81.69 66.14,82.56 | E.SW1 66.14,82.56 | 65.41,81.69 | 65.41,81.69 64.67,82.56 | E.SW1 64.67,82.56 | 65.41,84.69 66.14,83.81 | 65.41,84.69 66.14,83.81 | E.SW1 66.14,83.81 | 65.41,84.69 64.67,83.81 | E.SW1 64.67,83.81 | 65.41,84.69 66.14,83.81 | 66.14,83.81 | 65.41,84.69 64.67,83.81 | 64.67,83.81 | E.SW1 64.67,83.81 | 65.41,84.69 66.14,83.81 | E.SW1 66.14,83.81 | 65.41,84.69 64.67,83.81 | E.SW1 64.67,83.81 | 65.41,84.69 66.14,83.81 | E.SW1 66.14,83.81 | 65.41,81.69 66.14,82.56 | 65.41,81.69 64.67,82.56 | 64.67,82.56 | E.SW1 64.67,82.56 | 65.41,81.69 66.14,82.56 | 66.14,82.56 | E.SW1 66.14,82.56 | 65.41,81.69 64.67,82.56 | E.SW1 64.67,82.56 | 65.41,81.69 66.14,82.56 | E.SW1 66.14,82.56 | 65.41,81.69 64.67,82.56 | E.SW1 64.67,82.56 | 198.75,84.69 198.02,83.81 | 198.75,84.69 | 198.75,84.69 198.02,83.81 | P.SW1 198.02,83.81 | 198.75,84.69 199.49,83.81 | 198.75,84.69 | 198.75,84.69 198.02,83.81 | 198.75,84.69 | 198.75,84.69 199.49,83.81 | 199.49,83.81 | 198.75,84.69 199.49,83.81 | 198.75,84.69 199.49,83.81 | P.SW1 199.49,83.81 | 198.75,84.69 198.02,83.81 | P.SW1 198.02,83.81 | 198.75,84.69 199.49,83.81 | 199.49,83.81 | 198.75,84.69 198.02,83.81 | 198.02,83.81 | P.SW1 198.02,83.81 | 198.75,84.69 199.49,83.81 | P.SW1 199.49,83.81 | 198.75,84.69 198.02,83.81 | P.SW1 198.02,83.81 | 198.75,84.69 199.49,83.81 | P.SW1 199.49,83.81 | 199.55,27.54 198.81,26.66 UP_ARR.SW1 | 199.55,27.54 200.29,26.66 UP_ARR.SW1 | 208.81,101.17 | 208.81,101.17 209.95,101.27 | 209.95,101.27 | 208.81,101.17
  Bottom 0.61: 208.81,101.17 208.91,102.32 | 208.91,102.32 | 208.81,101.17 208.91,102.32 | 208.91,102.32 | 208.81,101.17 209.95,101.27 | 209.95,101.27 | -_£.SW1 209.95,101.27 | 208.81,101.17 208.91,102.32 | -_£.SW1 208.91,102.32 | 208.81,101.17 209.95,101.27 | -_£.SW1 209.95,101.27 | 208.81,101.17 208.91,102.32 | -_£.SW1 208.91,102.32 | 75.46,101.17 | 75.46,101.17 76.6,101.27 | 76.6,101.27 | 75.46,101.17 | 75.46,101.17 75.56,102.32 | 75.56,102.32 | 75.46,101.17 75.56,102.32 | 75.56,102.32 | 75.46,101.17 76.6,101.27 | 76.6,101.27 | 4_$.SW1 76.6,101.27 | 75.46,101.17 75.56,102.32 | 4_$.SW1 75.56,102.32 | 75.46,101.17 76.6,101.27 | 4_$.SW1 76.6,101.27 | 75.46,101.17 75.56,102.32 | 4_$.SW1 75.56,102.32 | F.SW1 90.98,63.19 | F.SW1 89.84,64.12 | 90.81,62.63 90.07,63.51 | 89.74,65.2 89.84,64.05 | 89.84,64.05 | 89.74,65.2 | 89.74,65.2 89.84,64.05 | F.SW1 89.84,64.05 | 89.74,65.2 90.89,65.1 | 90.89,65.1 | F.SW1 90.89,65.1 | 90.81,62.63 | 90.81,62.63 91.54,63.51 | 91.54,63.51 | 90.81,62.63 | 90.81,62.63 90.07,63.51 | 90.81,62.63 91.54,63.51 | F.SW1 91.54,63.51 | 90.81,62.63 | 90.81,62.63 90.07,63.51 | F.SW1 90.07,63.51 | 89.74,65.2 89.84,64.05 | F.SW1 89.84,64.05 | 89.74,65.2 90.89,65.1 | F.SW1 90.89,65.1 | 90.81,62.63 91.54,63.51 | 90.81,62.63 90.07,63.51 | 90.07,63.51 | F.SW1 90.07,63.51 | 90.81,62.63 91.54,63.51 | 91.54,63.51 | F.SW1 91.54,63.51 | 90.81,62.63 90.07,63.51 | F.SW1 90.07,63.51 | 90.81,62.63 91.54,63.51 | F.SW1 91.54,63.51 | 90.81,62.63 90.07,63.51 | F.SW1 90.07,63.51 | 98.83,45.09 99.71,44.35 | 98.83,45.09 | 98.83,45.09 99.71,44.35 | V.SW1 99.71,44.35 | 98.83,45.09 99.71,45.82 | 98.83,45.09 | 98.83,45.09 99.71,44.35 | 98.83,45.09 | 98.83,45.09 99.71,45.82 | 99.71,45.82 | 98.83,45.09 99.71,45.82 | 98.83,45.09 99.71,45.82
  Bottom 0.61: V.SW1 99.71,45.82 | 98.83,45.09 99.71,44.35 | V.SW1 99.71,44.35 | 98.83,45.09 99.71,45.82 | 99.71,45.82 | 98.83,45.09 99.71,44.35 | 99.71,44.35 | V.SW1 99.71,44.35 | 98.83,45.09 99.71,45.82 | V.SW1 99.71,45.82 | 98.83,45.09 99.71,44.35 | V.SW1 99.71,44.35 | 98.83,45.09 99.71,45.82 | V.SW1 99.71,45.82
COL_4
  Bottom 0.61: CTRL.SW1 14.61,62.63 | 14.61,62.63 | 14.61,62.63 14.61,46.59 | 14.61,46.59 | 14.61,46.59 LEFT_SH.SW1 | CTRL.SW1 13.54,65.2 | 13.54,65.2 | 13.54,65.2 4.45,74.3 4.45,93.34 29.84,118.75 167.64,118.75 168.21,119.31 JP1.12 | LEFT_SH.SW1 14.61,43.59 | 14.61,43.59 | 14.61,43.59 14.61,33.66 36.2,12.06 98.42,12.06 100.33,13.97 142.88,13.97 152.4,23.5 183.51,23.5 191.13,15.88 227.49,15.88 236.59,24.97 | 13.54,65.2 | 13.54,65.2 13.64,64.05 | 13.64,64.05 | 13.54,65.2 14.69,65.1 | 14.69,65.1 | 14.61,62.63 15.34,63.51 | 14.61,43.59 15.34,44.46 | FUNC.SW1 237.65,27.54 | 237.65,27.54 237.65,39.53 242.14,44.02 | 242.14,44.02 RHT_SH.SW1 | FUNC.SW1 236.59,24.97 | 242.14,44.02 243.29,44.12 RHT_SH.SW1 | 242.14,44.02 242.24,45.17 RHT_SH.SW1 | 14.61,62.63 13.87,63.51 | 13.54,65.2 13.64,64.05 | 13.64,64.05 | 13.54,65.2 | 13.54,65.2 13.64,64.05 | CTRL.SW1 13.64,64.05 | 13.54,65.2 14.69,65.1 | 14.69,65.1 | CTRL.SW1 14.69,65.1 | 14.61,62.63 | 14.61,62.63 15.34,63.51 | 15.34,63.51 | 14.61,62.63 | 14.61,62.63 13.87,63.51 | 14.61,62.63 15.34,63.51 | CTRL.SW1 15.34,63.51 | 14.61,62.63 | 14.61,62.63 13.87,63.51 | CTRL.SW1 13.87,63.51 | 14.61,62.63 15.34,63.51 | 14.61,62.63 13.87,63.51 | 13.87,63.51 | CTRL.SW1 13.87,63.51 | 14.61,62.63 15.34,63.51 | 15.34,63.51 | CTRL.SW1 15.34,63.51 | 14.61,62.63 13.87,63.51 | CTRL.SW1 13.87,63.51 | 14.61,62.63 15.34,63.51 | CTRL.SW1 15.34,63.51 | 14.61,62.63 13.87,63.51 | CTRL.SW1 13.87,63.51 | 13.54,65.2 13.64,64.05 | CTRL.SW1 13.64,64.05 | 13.54,65.2 14.69,65.1 | CTRL.SW1 14.69,65.1 | 14.61,46.59 13.87,45.71 | 14.61,43.59 13.87,44.46 | 14.61,46.59 | 14.61,46.59 13.87,45.71 | LEFT_SH.SW1 13.87,45.71 | 14.61,46.59 15.34,45.71 | 14.61,46.59 | 14.61,46.59 13.87,45.71 | 14.61,46.59
  Bottom 0.61: 14.61,46.59 15.34,45.71 | 15.34,45.71 | 14.61,43.59 | 14.61,43.59 15.34,44.46 | 15.34,44.46 | 14.61,43.59 | 14.61,43.59 13.87,44.46 | 14.61,43.59 15.34,44.46 | LEFT_SH.SW1 15.34,44.46 | 14.61,43.59 | 14.61,43.59 13.87,44.46 | LEFT_SH.SW1 13.87,44.46 | 14.61,46.59 15.34,45.71 | 14.61,46.59 15.34,45.71 | LEFT_SH.SW1 15.34,45.71 | 14.61,46.59 13.87,45.71 | LEFT_SH.SW1 13.87,45.71 | 14.61,46.59 15.34,45.71 | 15.34,45.71 | 14.61,46.59 13.87,45.71 | 13.87,45.71 | LEFT_SH.SW1 13.87,45.71 | 14.61,46.59 15.34,45.71 | LEFT_SH.SW1 15.34,45.71 | 14.61,46.59 13.87,45.71 | LEFT_SH.SW1 13.87,45.71 | 14.61,46.59 15.34,45.71 | LEFT_SH.SW1 15.34,45.71 | 14.61,43.59 15.34,44.46 | 14.61,43.59 13.87,44.46 | 13.87,44.46 | LEFT_SH.SW1 13.87,44.46 | 14.61,43.59 15.34,44.46 | 15.34,44.46 | LEFT_SH.SW1 15.34,44.46 | 14.61,43.59 13.87,44.46 | LEFT_SH.SW1 13.87,44.46 | 14.61,43.59 15.34,44.46 | LEFT_SH.SW1 15.34,44.46 | 14.61,43.59 13.87,44.46 | LEFT_SH.SW1 13.87,44.46 | 237.65,27.54 236.91,26.66 FUNC.SW1 | 237.65,27.54 238.39,26.66 FUNC.SW1 | 236.59,24.97 237.73,25.07 FUNC.SW1 | 236.59,24.97 236.69,26.12 FUNC.SW1
COL_5  (via drill 0.7)
  Top 0.61: v165.74,116.84 165.74,117.75 | 165.74,117.75 165.74,121.28 JP1.11 | 165.54,116.89 | 165.74,117.75 165.54,116.89 | 165.74,117.75 165.54,116.89 | v165.74,116.84 165.54,116.89 | 165.74,117.75 | 165.74,117.75 165.93,116.89 | 165.74,117.75 165.54,116.89 | 165.74,117.75 165.93,116.89 | 165.93,116.89 | 165.74,117.75 165.54,116.89 | 165.74,117.75 165.93,116.89 | v165.74,116.84 165.93,116.89 | 165.74,117.75 165.54,116.89 | v165.74,116.84 165.54,116.89 | 165.74,117.75 165.93,116.89 | v165.74,116.84 165.93,116.89
  Bottom 0.61: ESC.SW1 8.26,81.69 | 8.26,81.69 | 8.26,81.69 8.26,76.83 13.97,71.12 26.67,71.12 32.59,65.2 | 32.59,65.2 | 32.59,65.2 A.SW1 | Z.SW1 41.68,45.09 | 41.68,45.09 | 41.68,45.09 33.66,45.09 | A.SW1 33.66,62.63 | 33.66,62.63 | 33.66,62.63 33.66,45.09 | ESC.SW1 8.26,84.69 | 8.26,84.69 | 8.26,84.69 8.26,91.12 18.31,101.17 | 18.31,101.17 1_PLING.SW1 | RETURN.SW1 252.73,65.64 | 252.73,65.64 | 252.73,65.64 252.73,80.01 254.84,82.12 | 254.84,82.12 DEL.SW1 | 164.82,116.84 33.97,116.84 20.43,103.3 | 164.82,116.84 v165.74,116.84 | 255.91,84.69 255.91,92.08 259.71,95.89 259.71,104.14 249.56,114.3 217.17,114.3 214.63,116.84 167,116.84 | 255.91,84.69 | 255.91,84.69 DEL.SW1 | v165.74,116.84 167,116.84 | 166.38,116.83 167,116.84 | 1_PLING.SW1 20.43,103.3 | 20.43,103.3 | 166.38,116.83 165.91,116.95 | 165.91,116.95 | 166.38,116.83 165.63,116.67 | 165.63,116.67 | 32.59,65.2 | 32.59,65.2 32.69,64.05 | 32.69,64.05 | 32.59,65.2 33.74,65.1 | 33.74,65.1 | 33.66,62.63 34.39,63.51 | 8.26,81.69 8.99,82.56 | 20.43,103.3 19.28,103.2 | 19.28,103.2 | 20.43,103.3 20.33,102.15 | 20.33,102.15 | 166.38,116.83 165.91,116.95 | v165.74,116.84 165.91,116.95 | 166.38,116.83 165.63,116.67 | v165.74,116.84 165.63,116.67 | 165.69,116.64 | A.SW1 32.92,64.76 | 34.39,64.76 | 20.33,102.15 | 33.66,37.94 33.66,38.1 | 33.66,38.1 33.66,45.09 | LEFT_ARR.SW1 43.18,27.54 | 43.18,27.54 43.18,28.57 33.66,38.1 | 164.82,116.84 165.69,116.64 | 164.82,116.84 165.69,116.64 | v165.74,116.84 165.69,116.64 | 164.82,116.84 | 166.38,116.83 165.91,116.95 | 166.38,116.83 165.63,116.67 | 166.38,116.83 165.91,116.95 | v165.74,116.84 165.91,116.95 | 166.38,116.83 165.63,116.67 | v165.74,116.84 165.63,116.67 | 164.82,116.84 165.69,117.04 | 164.82,116.84 165.69,116.64
  Bottom 0.61: 164.82,116.84 165.69,117.04 | 165.69,117.04 | 164.82,116.84 165.69,116.64 | 164.82,116.84 165.69,117.04 | v165.74,116.84 165.69,117.04 | 164.82,116.84 165.69,116.64 | v165.74,116.84 165.69,116.64 | 164.82,116.84 165.69,117.04 | v165.74,116.84 165.69,117.04 | 166.38,116.83 165.91,116.95 | v165.74,116.84 165.91,116.95 | 166.38,116.83 165.63,116.67 | v165.74,116.84 165.63,116.67 | 252.73,65.64 251.99,64.76 | 252.73,65.64 | 252.73,65.64 251.99,64.76 | RETURN.SW1 251.99,64.76 | 252.73,65.64 253.47,64.76 | 252.73,65.64 | 252.73,65.64 251.99,64.76 | 252.73,65.64 | 252.73,65.64 253.47,64.76 | 253.47,64.76 | 252.73,65.64 253.47,64.76 | 252.73,65.64 253.47,64.76 | RETURN.SW1 253.47,64.76 | 252.73,65.64 251.99,64.76 | RETURN.SW1 251.99,64.76 | 252.73,65.64 253.47,64.76 | 253.47,64.76 | 252.73,65.64 251.99,64.76 | 251.99,64.76 | RETURN.SW1 251.99,64.76 | 252.73,65.64 253.47,64.76 | RETURN.SW1 253.47,64.76 | 252.73,65.64 251.99,64.76 | RETURN.SW1 251.99,64.76 | 252.73,65.64 253.47,64.76 | RETURN.SW1 253.47,64.76 | 34.39,64.76 | 33.66,62.63 32.92,63.51 | 32.59,65.2 32.69,64.05 | 32.69,64.05 | 32.59,65.2 | 32.59,65.2 32.69,64.05 | A.SW1 32.69,64.05 | 32.59,65.2 33.74,65.1 | 33.74,65.1 | A.SW1 33.74,65.1 | 32.92,64.76 | A.SW1 32.92,64.76 | A.SW1 34.39,64.76 | A.SW1 32.92,64.76 | A.SW1 34.39,64.76 | 33.66,62.63 | 33.66,62.63 34.39,63.51 | 34.39,63.51 | 33.66,62.63 | 33.66,62.63 32.92,63.51 | 33.66,62.63 34.39,63.51 | A.SW1 34.39,63.51 | 33.66,62.63 | 33.66,62.63 32.92,63.51 | A.SW1 32.92,63.51 | 32.59,65.2 32.69,64.05 | A.SW1 32.69,64.05 | 32.59,65.2 33.74,65.1 | A.SW1 33.74,65.1 | 33.66,62.63 34.39,63.51 | 33.66,62.63 32.92,63.51 | 32.92,63.51 | A.SW1 32.92,63.51 | 33.66,62.63 34.39,63.51 | 34.39,63.51 | A.SW1 34.39,63.51
  Bottom 0.61: 33.66,62.63 32.92,63.51 | A.SW1 32.92,63.51 | 33.66,62.63 34.39,63.51 | A.SW1 34.39,63.51 | 33.66,62.63 32.92,63.51 | A.SW1 32.92,63.51 | 254.84,82.12 | 254.84,82.12 255.99,82.22 | 255.99,82.22 | 254.84,82.12 | 254.84,82.12 254.94,83.27 | 254.94,83.27 | 255.91,84.69 255.17,83.81 | 254.84,82.12 254.94,83.27 | 254.94,83.27 | 255.91,84.69 | 255.91,84.69 255.17,83.81 | DEL.SW1 255.17,83.81 | 255.91,84.69 256.64,83.81 | 255.91,84.69 | 255.91,84.69 255.17,83.81 | 255.91,84.69 | 255.91,84.69 256.64,83.81 | 256.64,83.81 | 254.84,82.12 255.99,82.22 | 255.99,82.22 | DEL.SW1 255.99,82.22 | 254.84,82.12 254.94,83.27 | DEL.SW1 254.94,83.27 | 254.84,82.12 255.99,82.22 | DEL.SW1 255.99,82.22 | 254.84,82.12 254.94,83.27 | DEL.SW1 254.94,83.27 | 255.91,84.69 256.64,83.81 | 255.91,84.69 256.64,83.81 | DEL.SW1 256.64,83.81 | 255.91,84.69 255.17,83.81 | DEL.SW1 255.17,83.81 | 255.91,84.69 256.64,83.81 | 256.64,83.81 | 255.91,84.69 255.17,83.81 | 255.17,83.81 | DEL.SW1 255.17,83.81 | 255.91,84.69 256.64,83.81 | DEL.SW1 256.64,83.81 | 255.91,84.69 255.17,83.81 | DEL.SW1 255.17,83.81 | 255.91,84.69 256.64,83.81 | DEL.SW1 256.64,83.81 | 43.18,27.54 42.44,26.66 LEFT_ARR.SW1 | 43.18,27.54 43.92,26.66 LEFT_ARR.SW1 | 41.68,45.09 42.56,44.35 | 41.68,45.09 | 41.68,45.09 42.56,44.35 | Z.SW1 42.56,44.35 | 41.68,45.09 42.56,45.82 | 41.68,45.09 | 41.68,45.09 42.56,44.35 | 41.68,45.09 | 41.68,45.09 42.56,45.82 | 42.56,45.82 | 41.68,45.09 42.56,45.82 | 41.68,45.09 42.56,45.82 | Z.SW1 42.56,45.82 | 41.68,45.09 42.56,44.35 | Z.SW1 42.56,44.35 | 41.68,45.09 42.56,45.82 | 42.56,45.82 | 41.68,45.09 42.56,44.35 | 42.56,44.35 | Z.SW1 42.56,44.35 | 41.68,45.09 42.56,45.82 | Z.SW1 42.56,45.82 | 41.68,45.09 42.56,44.35 | Z.SW1 42.56,44.35 | 41.68,45.09 42.56,45.82
  Bottom 0.61: Z.SW1 42.56,45.82 | 8.26,81.69 7.52,82.56 | 8.26,84.69 7.52,83.81 | 8.26,81.69 | 8.26,81.69 8.99,82.56 | 8.99,82.56 | 8.26,81.69 | 8.26,81.69 7.52,82.56 | 8.26,81.69 8.99,82.56 | ESC.SW1 8.99,82.56 | 8.26,81.69 | 8.26,81.69 7.52,82.56 | ESC.SW1 7.52,82.56 | 8.26,84.69 | 8.26,84.69 7.52,83.81 | ESC.SW1 7.52,83.81 | 8.26,84.69 8.99,83.81 | 8.26,84.69 | 8.26,84.69 7.52,83.81 | 8.26,84.69 | 8.26,84.69 8.99,83.81 | 8.99,83.81 | 8.26,81.69 8.99,82.56 | 8.26,81.69 7.52,82.56 | 7.52,82.56 | ESC.SW1 7.52,82.56 | 8.26,81.69 8.99,82.56 | 8.99,82.56 | ESC.SW1 8.99,82.56 | 8.26,81.69 7.52,82.56 | ESC.SW1 7.52,82.56 | 8.26,81.69 8.99,82.56 | ESC.SW1 8.99,82.56 | 8.26,81.69 7.52,82.56 | ESC.SW1 7.52,82.56 | 8.26,84.69 8.99,83.81 | 8.26,84.69 8.99,83.81 | ESC.SW1 8.99,83.81 | 8.26,84.69 7.52,83.81 | ESC.SW1 7.52,83.81 | 8.26,84.69 8.99,83.81 | 8.99,83.81 | 8.26,84.69 7.52,83.81 | 7.52,83.81 | ESC.SW1 7.52,83.81 | 8.26,84.69 8.99,83.81 | ESC.SW1 8.99,83.81 | 8.26,84.69 7.52,83.81 | ESC.SW1 7.52,83.81 | 8.26,84.69 8.99,83.81 | ESC.SW1 8.99,83.81 | 18.31,101.17 | 18.31,101.17 19.45,101.27 | 19.45,101.27 | 18.31,101.17 | 18.31,101.17 18.41,102.32 | 18.41,102.32 | 19.28,103.2 | 1_PLING.SW1 19.28,103.2 | 20.43,103.3 20.33,102.15 | 1_PLING.SW1 20.33,102.15 | 20.43,103.3 19.28,103.2 | 1_PLING.SW1 19.28,103.2 | 20.43,103.3 20.33,102.15 | 1_PLING.SW1 20.33,102.15 | 18.31,101.17 18.41,102.32 | 18.41,102.32 | 18.31,101.17 19.45,101.27 | 19.45,101.27 | 1_PLING.SW1 19.45,101.27 | 18.31,101.17 18.41,102.32 | 1_PLING.SW1 18.41,102.32 | 18.31,101.17 19.45,101.27 | 1_PLING.SW1 19.45,101.27 | 18.31,101.17 18.41,102.32 | 1_PLING.SW1 18.41,102.32
COL_6  (via drill 0.7)
  Top 0.508: 107.95,120.65 111.76,124.46 131.81,124.46 | 131.81,124.46 v132.72,124.46 | 132.65,124.22 | 132.65,124.7 | 131.81,124.46 132.65,124.22 | 131.81,124.46 132.65,124.7 | 131.81,124.46 132.65,124.22 | v132.72,124.46 132.65,124.22 | 131.81,124.46 | 131.81,124.46 132.65,124.7 | v132.72,124.46 132.65,124.7 | 131.81,124.46 132.65,124.22 | 131.81,124.46 132.65,124.7 | 131.81,124.46 132.65,124.22 | 132.65,124.22 | v132.72,124.46 132.65,124.22 | 131.81,124.46 132.65,124.7 | 131.81,124.46 132.65,124.22 | v132.72,124.46 132.65,124.22 | 131.81,124.46 132.65,124.7 | v132.72,124.46 132.65,124.7
  Top 0.61: JP1.9 160.66,123.83 163.19,126.36 211.19,126.36 | 107.95,120.65 53.98,120.65 38.42,105.09 38.42,103.73 | 211.19,126.36 v212.09,126.36 | BS_PIPE.SW1 247.97,103.73 | 247.97,103.73 | 247.97,103.73 247.97,117.53 | 247.97,117.53 v247.97,118.43 | 2_@.SW1 38.42,103.73 | 38.42,103.73 | 248.16,118.38 | 247.77,118.38 | 212.05,126.17 | 212.05,126.56 | 247.97,117.53 248.16,118.38 | 247.97,117.53 | 247.97,117.53 247.77,118.38 | 247.97,117.53 248.16,118.38 | v247.97,118.43 248.16,118.38 | 247.97,117.53 247.77,118.38 | v247.97,118.43 247.77,118.38 | 247.97,117.53 248.16,118.38 | 247.97,117.53 247.77,118.38 | 247.97,117.53 248.16,118.38 | v247.97,118.43 248.16,118.38 | 247.97,117.53 247.77,118.38 | v247.97,118.43 247.77,118.38 | 211.19,126.36 212.05,126.17 | 211.19,126.36 212.05,126.56 | 211.19,126.36 212.05,126.17 | v212.09,126.36 212.05,126.17 | 211.19,126.36 | 211.19,126.36 212.05,126.56 | v212.09,126.36 212.05,126.56 | 211.19,126.36 212.05,126.17 | 211.19,126.36 212.05,126.56 | 211.19,126.36 212.05,126.17 | 211.19,126.36 212.05,126.56 | 211.19,126.36 212.05,126.17 | v212.09,126.36 212.05,126.17 | 211.19,126.36 212.05,126.56 | v212.09,126.36 212.05,126.56 | 247.97,103.73 247.23,102.86 | 247.97,103.73 | 247.97,103.73 247.23,102.86 | BS_PIPE.SW1 247.23,102.86 | 247.97,103.73 248.71,102.86 | 247.97,103.73 | 247.97,103.73 247.23,102.86 | 247.97,103.73 | 247.97,103.73 248.71,102.86 | 248.71,102.86 | 247.97,103.73 248.71,102.86 | 247.97,103.73 248.71,102.86 | BS_PIPE.SW1 248.71,102.86 | 247.97,103.73 247.23,102.86 | BS_PIPE.SW1 247.23,102.86 | 247.97,103.73 248.71,102.86 | 248.71,102.86 | 247.97,103.73 247.23,102.86 | 247.23,102.86 | BS_PIPE.SW1 247.23,102.86 | 247.97,103.73 248.71,102.86
  Top 0.61: BS_PIPE.SW1 248.71,102.86 | 247.97,103.73 247.23,102.86 | BS_PIPE.SW1 247.23,102.86 | 247.97,103.73 248.71,102.86 | BS_PIPE.SW1 248.71,102.86 | 38.42,103.73 37.68,102.86 | 38.42,103.73 | 38.42,103.73 37.68,102.86 | 2_@.SW1 37.68,102.86 | 38.42,103.73 39.16,102.86 | 38.42,103.73 | 38.42,103.73 37.68,102.86 | 38.42,103.73 | 38.42,103.73 39.16,102.86 | 39.16,102.86 | 38.42,103.73 39.16,102.86 | 38.42,103.73 39.16,102.86 | 2_@.SW1 39.16,102.86 | 38.42,103.73 37.68,102.86 | 2_@.SW1 37.68,102.86 | 38.42,103.73 39.16,102.86 | 39.16,102.86 | 38.42,103.73 37.68,102.86 | 37.68,102.86 | 2_@.SW1 37.68,102.86 | 38.42,103.73 39.16,102.86 | 2_@.SW1 39.16,102.86 | 38.42,103.73 37.68,102.86 | 2_@.SW1 37.68,102.86 | 38.42,103.73 39.16,102.86 | 2_@.SW1 39.16,102.86